# Altium project PCB_Project1.PrjPCB
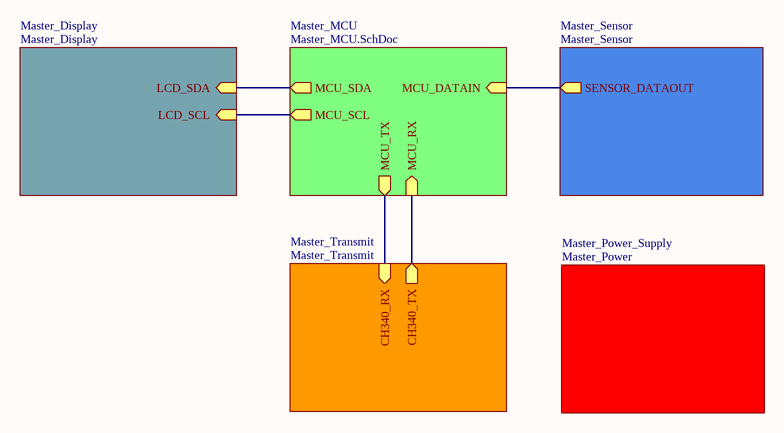
[diagram p0: Sheet-Connectors.SchDoc]
6 sheets, 38 parts. Net scope: hierarchical (ports join the sheet entries above them; power ports are global).
Board file: PCB_Project1.PcbDoc
Sheets:
  Sheet-Connectors.SchDoc
    Master_MCU = Master_MCU.SchDoc
    Master_Power_Supply = Master_Power.SchDoc
    Master_Sensor = Master_Sensor.SchDoc
    Master_Display = Master_Display.SchDoc
    Master_Transmit = Master_Transmit.SchDoc

## Sheet Sheet-Connectors.SchDoc
size A4; Organization: Altium Limited; Address1: L3, 12a Rodborough Rd; Address2: Frenchs Forest; Address3: NSW; Address4: Australia 2086

### Sub-sheets
Master_Display = Master_Display: LCD_SDA (in), LCD_SCL (in)
Master_MCU = Master_MCU.SchDoc: MCU_SDA (out), MCU_SCL (out), MCU_DATAIN (in), MCU_TX (out), MCU_RX (in)
Master_Power_Supply = Master_Power: no entries
Master_Sensor = Master_Sensor: SENSOR_DATAOUT (out)
Master_Transmit = Master_Transmit: CH340_TX (out), CH340_RX (in)

### Nets
NetJP1_1: sheet Master_MCU/MCU_SCL, sheet Master_Display/LCD_SCL
NetJP1_2: sheet Master_MCU/MCU_SDA, sheet Master_Display/LCD_SDA
NetJP3_2: sheet Master_MCU/MCU_DATAIN, sheet Master_Sensor/SENSOR_DATAOUT
NetLED2_2: sheet Master_MCU/MCU_RX, sheet Master_Transmit/CH340_TX
NetLED3_2: sheet Master_MCU/MCU_TX, sheet Master_Transmit/CH340_RX

### Notes on the sheet
- Labels drawn without touching a wire or pin: Page Contents:, Project:
- Size:
- Date:
- A4
- Ver:
- Time:
- Author:
- Checked by:
- File:

## Sheet Master_MCU.SchDoc
size A4; Organization: Altium Limited; Address1: L3, 12a Rodborough Rd; Address2: Frenchs Forest; Address3: NSW; Address4: Australia 2086
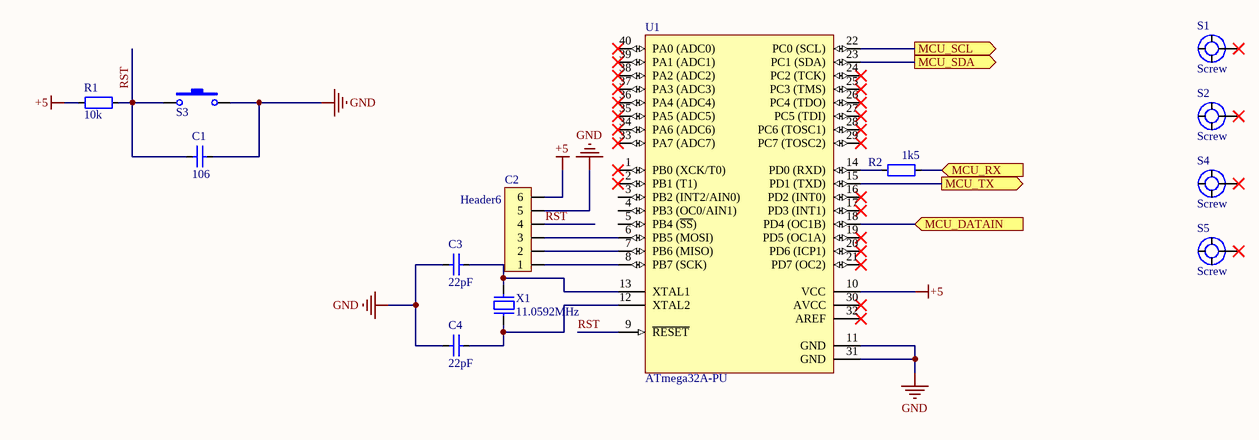
[diagram p1: Master_MCU.SchDoc]

### Parts
C1  106  [CAP_0805]
C2  Header6  [JP6H]
C3  22pF  [CAP_0805]
C4  22pF  [CAP_0805]
R1  10k  [RES-SMD-0805]
R2  1k5  [RES-SMD-0805]
S1  Screw  [Screw 3 small]
S2  Screw  [Screw 3 small]
S3  SW-SMD  [SW 3x2x4]  (value not drawn)
S4  Screw  [Screw 3 small]
S5  Screw  [Screw 3 small]
U1  ATmega32A-PU  [DIP40/W0.6]
X1  11.0592MHz  [XT2]

### Ports
MCU_DATAIN (in), MCU_RX (in), MCU_SCL (out), MCU_SDA (out), MCU_TX (out)

### Nets
+5: C2.6 R1.1 U1.10(VCC)
GND: C1.2 C2.5 C3.1 C4.1 S3.2 U1.11(GND) U1.31(GND)
RST: C1.1 C2.4 R1.2 S3.1 U1.9(~{RESET})
NetC2_1: C2.1 U1.8(PB7_(SCK))
NetC2_2: C2.2 U1.7(PB6_(MISO))
NetC2_3: C2.3 U1.6(PB5_(MOSI))
NetC3_2: C3.2 U1.13(XTAL1) X1.2
NetC4_2: C4.2 U1.12(XTAL2) X1.1
NetJP1_1: U1.22(PC0_(SCL)) ; port MCU_SCL
NetJP1_2: U1.23(PC1_(SDA)) ; port MCU_SDA
NetJP3_2: U1.18(PD4_(OC1B)) ; port MCU_DATAIN
NetLED2_2: R2.2 ; port MCU_RX
NetLED3_2: U1.15(PD1_(TXD)) ; port MCU_TX
NetR2_1: R2.1 U1.14(PD0_(RXD))

Not connected (* = marked no-connect by the designer): S1 1*; S2 1*; S4 1*; S5 1*; U1 1(PB0_(XCK/T0))* 2(PB1_(T1))* 3(PB2_(INT2/AIN0)) 4(PB3_(OC0/AIN1)) 5(PB4_(~{SS})) 16(PD2_(INT0))* 17(PD3_(INT1))* 19(PD5_(OC1A))* 20(PD6_(ICP1))* 21(PD7_(OC2))* 24(PC2_(TCK))* 25(PC3_(TMS))* 26(PC4_(TDO))* 27(PC5_(TDI))* 28(PC6_(TOSC1))* 29(PC7_(TOSC2))* 30(AVCC)* 32(AREF)* 33(PA7_(ADC7))* 34(PA6_(ADC6))* 35(PA5_(ADC5))* 36(PA4_(ADC4))* 37(PA3_(ADC3))* 38(PA2_(ADC2))* 39(PA1_(ADC1))* 40(PA0_(ADC0))*

### Notes on the sheet
- Labels drawn without touching a wire or pin: Page Contents:, Project:
- Size:
- Date:
- A4
- Ver:
- Time:
- Author:
- Checked by:
- File:

### Library data of the parts
C1 C3 C4 = CapSMD: Capacitor; Value: 33p; Published: 8-Jun-2000; LatestRevisionDate: 17-Jul-2002; LatestRevisionNote: Re-released for DXP Platform.; PackageReference: RAD-0.3; Publisher: Altium Limited
C2 = Header6: Header IDC, 6 x 1 Pin Vertical 2.54mm Pitch (Non-Boxed, Male); Manufacturer: W¨¹rth Elektronik eiSos GmbH; partNo: 613002143121; ComponentLink1 Description: Manufacturer; ComponentLink2 Description: Datasheet; NoPins: 02; Created Date: 29 March 2013; ComponentLink1URL: http://www.we-online.com; ComponentLink2URL: http://katalog.we-online.de/em/datasheet/6130xx143121.pdf; Created by: Karrer Zheng
R1 R2 = Resistor - SMD: Resistor; Manufacturer: Generic Components; Class: Passive; Published: 08/06/2000; Publisher: Altium Hobart Technology Centre
S3 = SW-SMD: Switch; Published: 24-Mar-1999; LatestRevisionDate: 17-Jul-2002; LatestRevisionNote: Re-released for DXP Platform.; PackageReference: SPST-2; Publisher: Altium Limited
U1 = ATmega32A-PU: 8-Bit AVR Microcontroller with 32K Bytes of In-System Programmable Flash Memory; Published: 17-Sep-2003; DatasheetVersion: 2503C-AVR-10/02; PackageVersion: revB, Sep-2001; PackageReference: 40P6; Publisher: Altium Limited; PackageDescription: 40-lead (0.600"/15.24mm Wide) Plastic Dual Inline Package (PDIP); Supplier 1: Digi-Key; Supplier Part Number 1: ATMEGA32-16PC-ND; Supplier 2: Mouser; Supplier Part Number 2: 556-ATMEGA32-16PC; Code_JEDEC: MS-011-AC; ComponentLink1Description: Datasheet; ComponentLink1URL: http://www.atmel.com/dyn/resources/prod_documents/doc2503.pdf; ComponentLink2Description: Atmel.com Home; ComponentLink2URL: http://www.atmel.com
X1 = XT2: Crystal For all Crystal 2pin.; Value: 4Mhz

## Sheet Master_Power.SchDoc
size A4; Organization: Altium Limited; Address1: L3, 12a Rodborough Rd; Address2: Frenchs Forest; Address3: NSW; Address4: Australia 2086
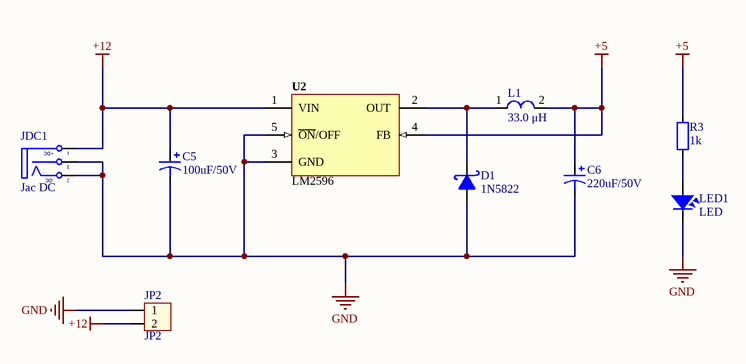
[diagram p2: Master_Power.SchDoc]

### Parts
C5  100uF/50V  [C8mm]
C6  220uF/50V  [C8mm]
D1  1N5822  [SMA]
JDC1  Jac DC  [DC-IN]
JP2  JP2  [CON2]
L1  33.0 μH  [L-SMD-M-7.3x4.5]
LED1  LED  [LED-0805-Red]
R3  1k  [RES-SMD-0805]
U2  LM2596  [TO263-5]

### Nets
+5: C6.1 L1.2 R3.2 U2.4(FB)
+12: C5.1 JDC1.1(T) JP2.2 U2.1(VIN)
GND: C5.2 C6.2 D1.1(A) JDC1.2(TN) JDC1.3(S) JP2.1 LED1.2 U2.3(GND) U2.5(~{ON}/OFF)
NetD1_2: D1.2(K) L1.1 U2.2(OUT)
NetLED1_1: LED1.1 R3.1

### Notes on the sheet
- Labels drawn without touching a wire or pin: Page Contents:, Project:
- Size:
- Date:
- A4
- Ver:
- Time:
- Author:
- Checked by:
- File:
- (in symbol DCIN) +DC; -DC

### Library data of the parts
C5 C6 = Cap Pol: Polarized Capacitor (Axial); Published: 8-Jun-2000; LatestRevisionDate: 17-Jul-2002; LatestRevisionNote: Re-released for DXP Platform.; PackageReference: POLAR0.8; Publisher: Altium Limited
D1 = 1N5822: Schottky Rectifiers; Value: Diode c?m 1N5408
JDC1 = DCIN: Jac DC input; Value: Jac DC
JP2 = Con2: Connector 2; Value: Connector 2
L1 = L-SMD-1: partNo: 78477010; Manufacturer: Wurth Elektronik; Inductance: 33.0 μH; ComponentLink1Description: Manufacturer; ComponentLink1URL: http://www.we-online.de; Created by: Baojun Chen; Created Date: Nov.2015; ComponentLink2Description: Datasheet; ComponentLink2URL: http://katalog.we-online.de/pbs/datasheet/78477010.pdf
LED1 = LED: LED Single colour Green and Red; Value: LED 3 ly Single Colour
R3 = Resistor - SMD: as R1 on sheet Master_MCU; Published: 08/06/2000; Publisher: Altium Hobart Technology Centre
U2 = LM2596: Max Input Voltage: 12 V; Max Output Current: 3 (6.0 peak) A; Max Output Voltage: mV; Category: IC-Power; Min Input Voltage: mV; Min Output Voltage: mV; Mounting Technology: Surface Mount; Status: Unreleased; Supply Voltage: mV; Temperature Range: -40 to +125 degC

## Sheet Master_Sensor.SchDoc
size A4; Organization: Altium Limited; Address1: L3, 12a Rodborough Rd; Address2: Frenchs Forest; Address3: NSW; Address4: Australia 2086
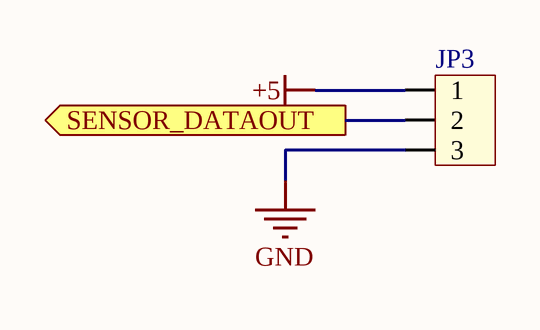
[diagram p3: Master_Sensor.SchDoc]

### Parts
JP3  JP3  [JP3H]  (value not drawn)

### Ports
SENSOR_DATAOUT (out)

### Nets
+5: JP3.1
GND: JP3.3
NetJP3_2: JP3.2 ; port SENSOR_DATAOUT

### Notes on the sheet
- Labels drawn without touching a wire or pin: Page Contents:, Project:
- Size:
- Date:
- A4
- Ver:
- Time:
- Author:
- Checked by:
- File:

### Library data of the parts
JP3 = Con3: Connector 3; Value: Connector 3

## Sheet Master_Display.SchDoc
size A4; Organization: Altium Limited; Address1: L3, 12a Rodborough Rd; Address2: Frenchs Forest; Address3: NSW; Address4: Australia 2086
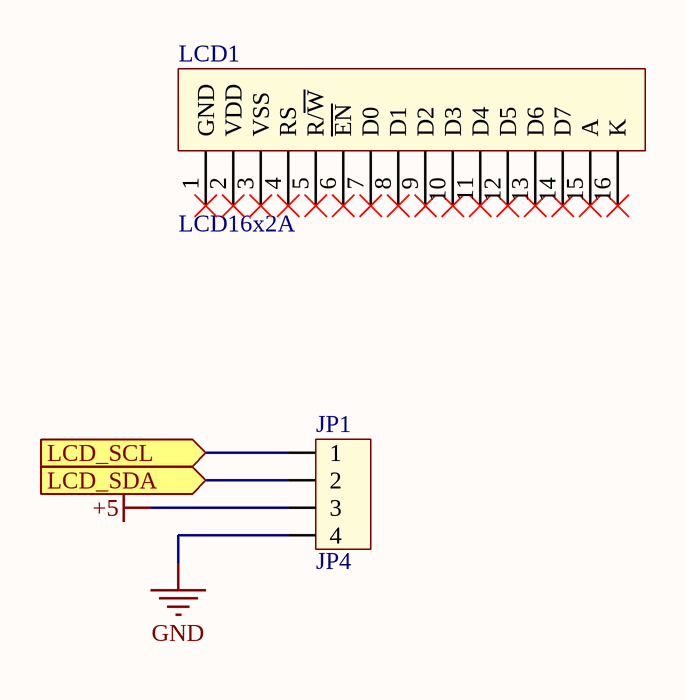
[diagram p4: Master_Display.SchDoc]

### Parts
JP1  JP4  [CON4]
LCD1  LCD16x2A  [LCD16X2N]

### Ports
LCD_SCL (in), LCD_SDA (in)

### Nets
+5: JP1.3
GND: JP1.4
NetJP1_1: JP1.1 ; port LCD_SCL
NetJP1_2: JP1.2 ; port LCD_SDA

Not connected (* = marked no-connect by the designer): LCD1 1(GND)* 2(VDD)* 3(VSS)* 4(RS)* 5(R/~{W})* 6(~{EN})* 7(D0)* 8(D1)* 9(D2)* 10(D3)* 11(D4)* 12(D5)* 13(D6)* 14(D7)* 15(A)* 16(K)*

### Notes on the sheet
- Labels drawn without touching a wire or pin: Page Contents:, Project:
- Size:
- Date:
- A4
- Ver:
- Time:
- Author:
- Checked by:
- File:

### Library data of the parts
JP1 = Con4: Connector 4; Value: Connector 4
LCD1 = LCD16x2: LCD dipslay 16 char, 2 line; Value: LCD16x2A

## Sheet Master_Transmit.SchDoc
size A4; Organization: Altium Limited; Address1: L3, 12a Rodborough Rd; Address2: Frenchs Forest; Address3: NSW; Address4: Australia 2086
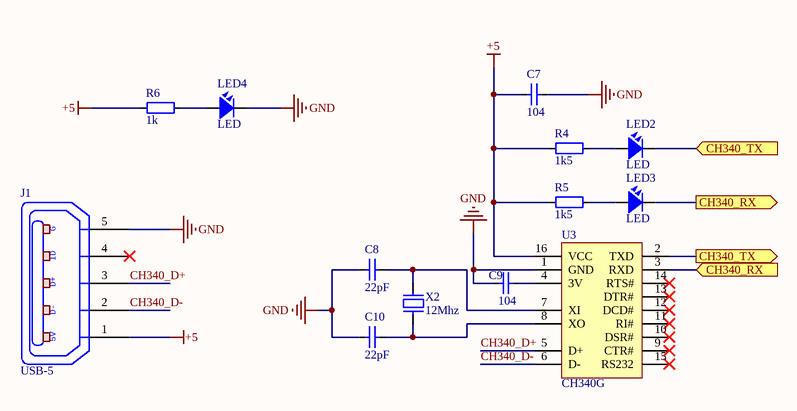
[diagram p5: Master_Transmit.SchDoc]

### Parts
C7  104  [CAP_0805]
C8  22pF  [CAP_0805]
C9  104  [CAP_0805]
C10  22pF  [CAP_0805]
J1  USB-5  [USB-M1]
LED2  LED  [LED-0805-Green]
LED3  LED  [LED-0805-Blue]
LED4  LED  [LED-0805-Red]
R4  1k5  [RES-SMD-0805]
R5  1k5  [RES-SMD-0805]
R6  1k  [RES-SMD-0805]
U3  CH340G  [SO16]
X2  12Mhz  [XT2]

### Ports
CH340_RX (in), CH340_RX (out), CH340_TX (in), CH340_TX (out)

### Nets
+5: C7.1 J1.1(P1) R4.2 R5.2 R6.2 U3.16(VCC)
GND: C7.2 C8.1 C9.1 C10.1 J1.5(P5) LED4.2 U3.1(GND)
CH340_D+: J1.3(P3) U3.5(D+)
CH340_D-: J1.2(P2) U3.6(D-)
NetC8_2: C8.2 U3.7(XI) X2.2
NetC9_2: C9.2 U3.4(3V)
NetC10_2: C10.2 U3.8(XO) X2.1
NetLED2_1: LED2.1 R4.1
NetLED2_2: LED2.2 U3.2(TXD) ; port CH340_TX
NetLED3_1: LED3.1 R5.1
NetLED3_2: LED3.2 U3.3(RXD) ; port CH340_RX
NetLED4_1: LED4.1 R6.1

Not connected (* = marked no-connect by the designer): J1 4(P4)*; U3 9(CTR#)* 10(DSR#)* 11(RI#)* 12(DCD#)* 13(DTR#)* 14(RTS#)* 15(RS232)*

### Notes on the sheet
- Labels drawn without touching a wire or pin: Page Contents:, Project:
- Size:
- Date:
- A4
- Ver:
- Time:
- Author:
- Checked by:
- File:
- (in symbol USB-5) G; ID; D+; D-; 5V

### Library data of the parts
C7-C10 = CapSMD: Capacitor; Value: 33p; Published: 8-Jun-2000; LatestRevisionDate: 17-Jul-2002; LatestRevisionNote: Re-released for DXP Platform.; PackageReference: RAD-0.3; Publisher: Altium Limited
J1 = USB-5: Manufacturer: FCI; Manufacturer Part Number: 10118193-0001LF; Connector Type: USB - micro B; Number of Contacts: 5; Gender: Receptacle; Specifications: USB 2.0; .Creator: MM; .Checked PCB: RF; Supplier 1: Digi-Key; RoHS: RoHS Compliant; Category: Connectors, Interconnects; Stock 1: 28642; Pricing 1: 1=0.46, 10=0.433, 25=0.3712, 50=0.3156, 100=0.3032, 250=0.27224, 500=0.25988 (USD); Packaging: Cut Tape (CT); Mounting Type: Surface Mount, Right Angle, Horizontal; Features: Shielded, Solder Retention; Ingress Protection: -; ComponentLink1URL: http://portal.fciconnect.com/Comergent//fci/drawing/10118193.pdf; ComponentLink1Description: http://portal.fciconnect.com/Comergent//fci/drawing/10118193.pdf; Supplier Part Number 1: 609-4616-1-ND; .Checked SCH: MM
LED2-LED4 = LED: as LED1 on sheet Master_Power
R4-R6 = Resistor - SMD: as R1 on sheet Master_MCU; Published: 08/06/2000; Publisher: Altium Hobart Technology Centre
U3 = CH340G: High and Low Side Driver; Note: Pins 4, 8 and 14 are not connected; Published: 8-Jun-2000; LatestRevisionDate: 04-Mar-2005; LatestRevisionNote: Stylized 3D Model Added.; DatasheetVersion: PD60147J; PackageReference: PDIP14; Publisher: Altium Limited; PackageDescription: DIP; 14 Leads; Row Spacing 7.62 mm; Pitch 2.54 mm; ComponentLink1Description: Manufacturer Link; ComponentLink1URL: http://www.irf.com/; ComponentLink2Description: Datasheet; ComponentLink2URL: http://www.irf.com/product-info/datasheets/data/ir2110.pdf
X2 = XT2: as X1 on sheet Master_MCU

## Nets that join several sheets
+5: Master_MCU (C2.6 R1.1 U1.10), Master_Power (C6.1 L1.2 R3.2 U2.4), Master_Sensor (JP3.1), Master_Display (JP1.3), Master_Transmit (6 pins)
GND: Master_MCU (7 pins), Master_Power (9 pins), Master_Sensor (JP3.3), Master_Display (JP1.4), Master_Transmit (7 pins)
NetJP1_1: Master_MCU (U1.22), Master_Display (JP1.1)
NetJP1_2: Master_MCU (U1.23), Master_Display (JP1.2)
NetJP3_2: Master_MCU (U1.18), Master_Sensor (JP3.2)
NetLED2_2: Master_MCU (R2.2), Master_Transmit (LED2.2 U3.2)
NetLED3_2: Master_MCU (U1.15), Master_Transmit (LED3.2 U3.3)